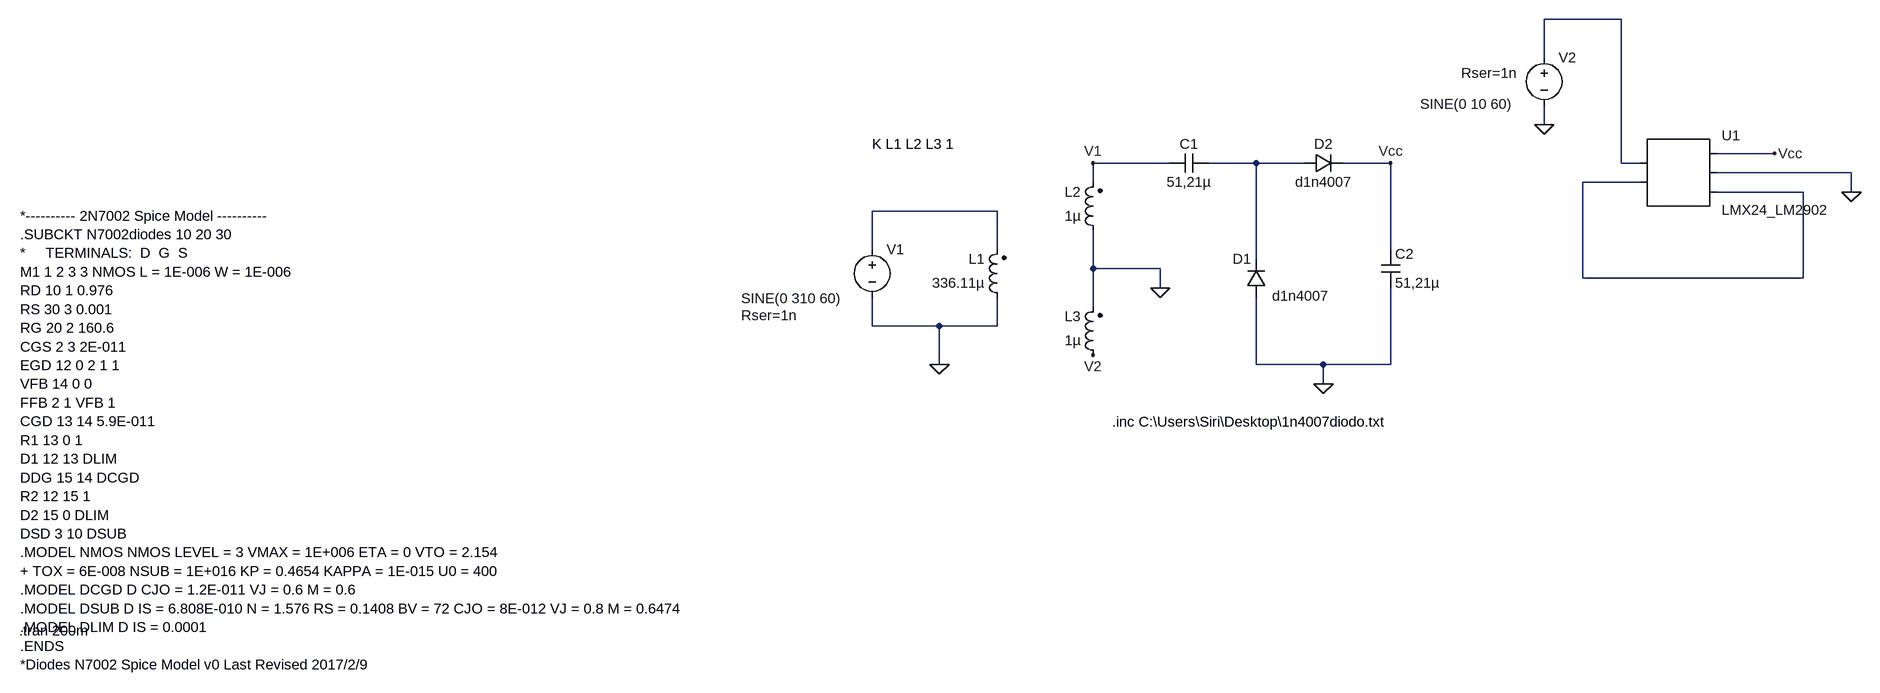
[diagram p0: schematic SimulacaoRelatorio3Parte1.asc]
SimulacaoRelatorio3Parte1.asc, the LTspice schematic file:
Version 4
SHEET 1 3540 680
WIRE 2656 -400 2528 -400
WIRE 2528 -336 2528 -400
WIRE 2528 -224 2528 -256
WIRE 2912 -176 2816 -176
WIRE 1904 -160 1776 -160
WIRE 2048 -160 1968 -160
WIRE 2128 -160 2048 -160
WIRE 2272 -160 2192 -160
WIRE 2656 -160 2656 -400
WIRE 2688 -160 2656 -160
WIRE 3040 -144 2816 -144
WIRE 1776 -128 1776 -160
WIRE 2688 -128 2592 -128
WIRE 2960 -112 2816 -112
WIRE 3040 -112 3040 -144
WIRE 1616 -80 1408 -80
WIRE 1408 -16 1408 -80
WIRE 1616 -16 1616 -80
WIRE 2272 -16 2272 -160
WIRE 2048 0 2048 -160
WIRE 1776 16 1776 -48
WIRE 1888 16 1776 16
WIRE 2592 32 2592 -128
WIRE 2960 32 2960 -112
WIRE 2960 32 2592 32
WIRE 1888 48 1888 16
WIRE 1776 80 1776 16
WIRE 1408 112 1408 64
WIRE 1520 112 1408 112
WIRE 1616 112 1616 64
WIRE 1616 112 1520 112
WIRE 1520 176 1520 112
WIRE 2048 176 2048 64
WIRE 2160 176 2048 176
WIRE 2272 176 2272 48
WIRE 2272 176 2160 176
WIRE 2160 208 2160 176
FLAG 1520 176 0
FLAG 1888 48 0
FLAG 2272 -160 Vcc
FLAG 1776 160 V2
FLAG 2912 -176 Vcc
FLAG 2528 -224 0
FLAG 2160 208 0
FLAG 1776 -160 V1
FLAG 3040 -112 0
SYMBOL voltage 1408 -32 R0
WINDOW 3 -218 98 Left 2
WINDOW 123 0 0 Left 0
WINDOW 39 -218 126 Left 2
SYMATTR InstName V1
SYMATTR Value SINE(0 310 60)
SYMATTR SpiceLine Rser=1n
SYMBOL ind2 1632 80 R180
WINDOW 0 36 80 Left 2
WINDOW 3 36 40 Left 2
SYMATTR InstName L1
SYMATTR Value 336.11µ
SYMATTR Type ind
SYMBOL ind2 1792 -32 R180
WINDOW 0 36 80 Left 2
WINDOW 3 36 40 Left 2
SYMATTR InstName L2
SYMATTR Value 1µ
SYMATTR Type ind
SYMBOL ind2 1792 176 R180
WINDOW 0 36 80 Left 2
WINDOW 3 36 40 Left 2
SYMATTR InstName L3
SYMATTR Value 1µ
SYMATTR Type ind
SYMBOL cap 1968 -176 R90
WINDOW 0 0 32 VBottom 2
WINDOW 3 32 32 VTop 2
SYMATTR InstName C1
SYMATTR Value 51,21µ
SYMBOL diode 2064 64 R180
WINDOW 0 24 64 Left 2
WINDOW 3 -105 2 Left 2
SYMATTR InstName D1
SYMATTR Value d1n4007
SYMBOL diode 2128 -144 R270
WINDOW 0 32 32 VTop 2
WINDOW 3 0 32 VBottom 2
SYMATTR InstName D2
SYMATTR Value d1n4007
SYMBOL cap 2256 -16 R0
SYMATTR InstName C2
SYMATTR Value 51,21µ
SYMBOL AutoGenerated\\LMX24_LM2902 2752 -144 R0
SYMATTR InstName U1
SYMBOL voltage 2528 -352 R0
WINDOW 3 -207 94 Left 2
WINDOW 123 0 0 Left 0
WINDOW 39 -138 42 Left 2
SYMATTR InstName V2
SYMATTR Value SINE(0 10 60)
SYMATTR SpiceLine Rser=1n
TEXT -240 -72 Left 2 !*---------- 2N7002 Spice Model ----------\n.SUBCKT N7002diodes 10 20 30\n*     TERMINALS:  D  G  S\nM1 1 2 3 3 NMOS L = 1E-006 W = 1E-006\nRD 10 1 0.976\nRS 30 3 0.001\nRG 20 2 160.6\nCGS 2 3 2E-011\nEGD 12 0 2 1 1\nVFB 14 0 0\nFFB 2 1 VFB 1\nCGD 13 14 5.9E-011\nR1 13 0 1\nD1 12 13 DLIM\nDDG 15 14 DCGD\nR2 12 15 1\nD2 15 0 DLIM\nDSD 3 10 DSUB\n.MODEL NMOS NMOS LEVEL = 3 VMAX = 1E+006 ETA = 0 VTO = 2.154\n+ TOX = 6E-008 NSUB = 1E+016 KP = 0.4654 KAPPA = 1E-015 U0 = 400\n.MODEL DCGD D CJO = 1.2E-011 VJ = 0.6 M = 0.6\n.MODEL DSUB D IS = 6.808E-010 N = 1.576 RS = 0.1408 BV = 72 CJO = 8E-012 VJ = 0.8 M = 0.6474\n.MODEL DLIM D IS = 0.0001\n.ENDS\n*Diodes N7002 Spice Model v0 Last Revised 2017/2/9
TEXT -242 620 Left 2 !.tran 200m
TEXT 1808 272 Left 2 !.inc C:\\Users\\Siri\\Desktop\\1n4007diodo.txt
TEXT 1408 -192 Left 2 !K L1 L2 L3 1

The netlist it stands for:
* SimulacaoRelatorio3Parte1.asc
V1 N004 0 SINE(0 310 60) Rser=1n
L1 0 N004 336.11µ
L2 0 V1 1µ
L3 V2 0 1µ
C1 N002 V1 51,21µ
D1 0 N002 d1n4007
D2 N002 Vcc d1n4007
C2 Vcc 0 51,21µ
* U1: LMX24_LM2902 (symbol AutoGenerated\LMX24_LM2902 not available, pins judged from their places): pin1=N001 pin2=N003 pin3=Vcc pin4=0 pin5=N003
V2 N001 0 SINE(0 10 60) Rser=1n
.model D D
.lib standard.dio
*---------- 2N7002 Spice Model ----------
.SUBCKT N7002diodes 10 20 30
*     TERMINALS:  D  G  S
M1 1 2 3 3 NMOS L = 1E-006 W = 1E-006
RD 10 1 0.976
RS 30 3 0.001
RG 20 2 160.6
CGS 2 3 2E-011
EGD 12 0 2 1 1
VFB 14 0 0
FFB 2 1 VFB 1
CGD 13 14 5.9E-011
R1 13 0 1
D1 12 13 DLIM
DDG 15 14 DCGD
R2 12 15 1
D2 15 0 DLIM
DSD 3 10 DSUB
.MODEL NMOS NMOS LEVEL = 3 VMAX = 1E+006 ETA = 0 VTO = 2.154
+ TOX = 6E-008 NSUB = 1E+016 KP = 0.4654 KAPPA = 1E-015 U0 = 400
.MODEL DCGD D CJO = 1.2E-011 VJ = 0.6 M = 0.6
.MODEL DSUB D IS = 6.808E-010 N = 1.576 RS = 0.1408 BV = 72 CJO = 8E-012 VJ = 0.8 M = 0.6474
.MODEL DLIM D IS = 0.0001
.ENDS
*Diodes N7002 Spice Model v0 Last Revised 2017/2/9
.tran 200m
.inc C:\Users\Siri\Desktop\1n4007diodo.txt
K L1 L2 L3 1
.backanno
.end